# Altium schematic sheet radio.schdoc: Radio
size 431 x 279 mm; DrawnBy: D. Bruey, M.Ciuffo; Organization: Synapse Product Development, LLC.; Address1: 1511 6th Ave., Suite 400; Address2: Seattle, Washington 98101; Address3: 206.381.0898; Address4: www.synapse.com; DocumentNumber: 8; SheetNumber: 7; SheetTotal: 10; PageSetup: Record=PageOptions|CenterHorizontal=True|CenterVertical=True|PrintScale=0.95|XCorrection=1.00|YCorrection=1.00|PrintKind=1|BorderSize=5000000|LeftOffset=0|BottomOffset=0|Orientation=2|PaperLength=4318|PaperWidth=2794|Scale=100|PaperSource=7|PrintQuality=200|MediaType=1|DitherType=10|PrintScaleMode=1|PaperKind=11x17|PaperIndex=3
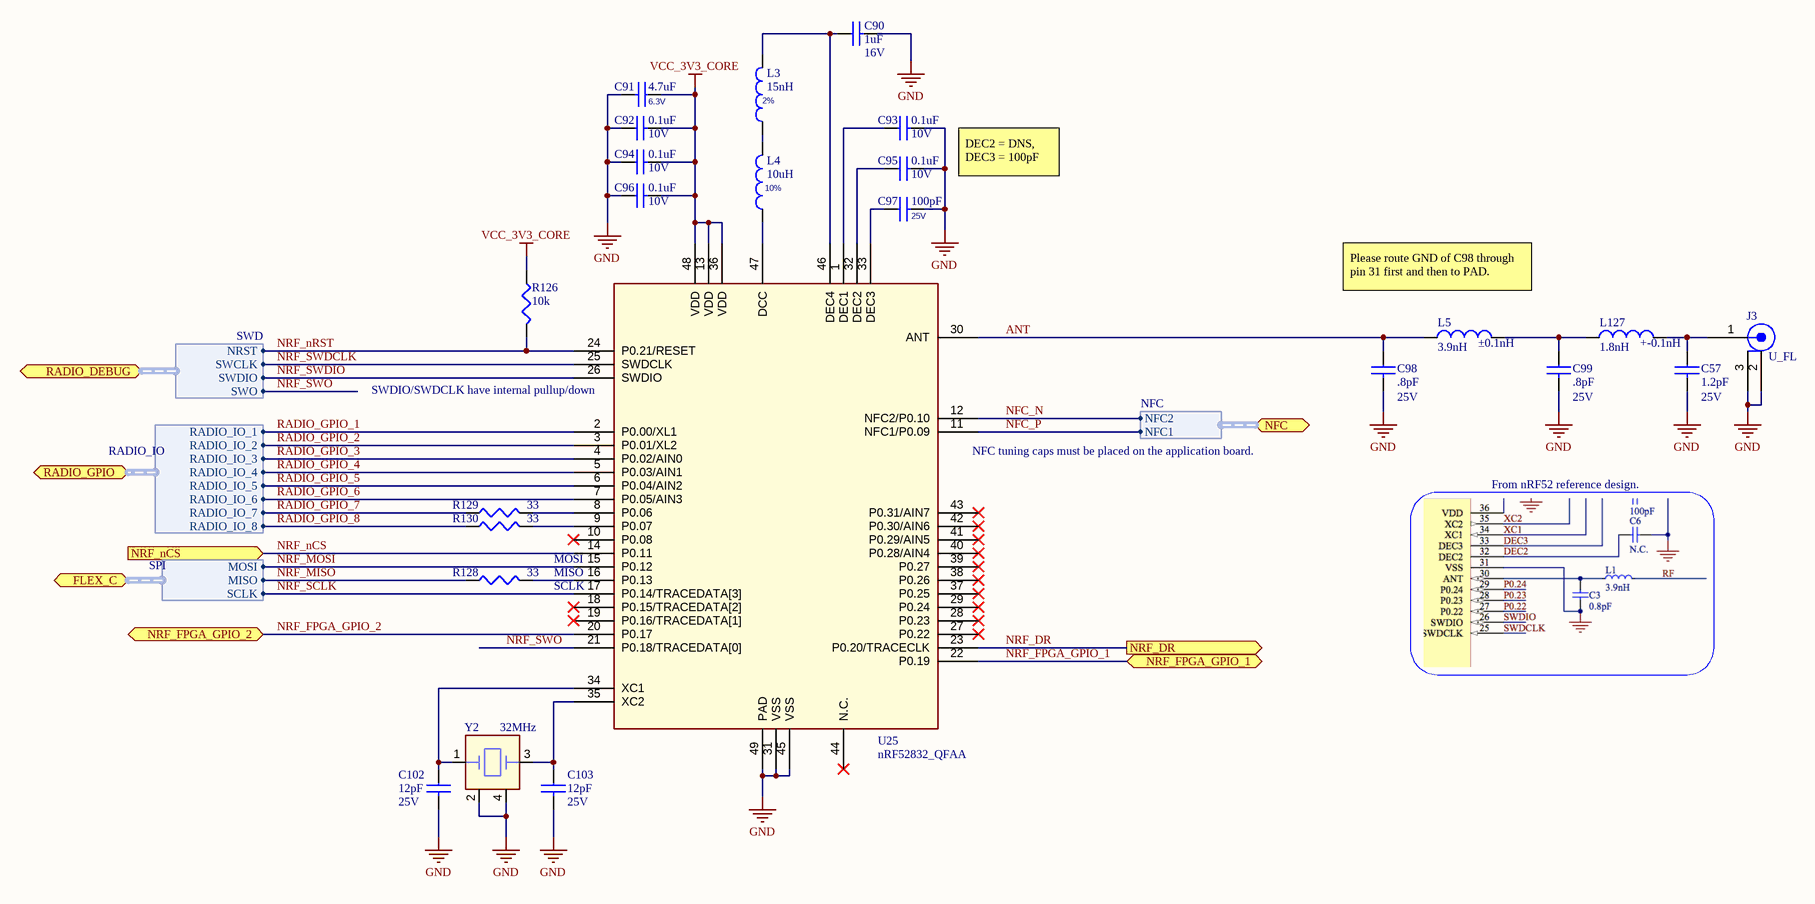
[diagram p0: radio.schdoc]

## Parts
C57  1.2pF  Voltage: 25V  [0201-IPCsm_33]
C90  1uF  Voltage: 16V  [0402-IPCsm_55]
C91  4.7uF  Voltage: 6.3V  [0402-IPCsm_55]
C92  0.1uF  Voltage: 10V  [0201-IPCsm_33]
C93  0.1uF  Voltage: 10V  [0201-IPCsm_33]
C94  0.1uF  Voltage: 10V  [0201-IPCsm_33]
C95  0.1uF  Voltage: 10V  [0201-IPCsm_33]
C96  0.1uF  Voltage: 10V  [0201-IPCsm_33]
C97  100pF  Voltage: 25V  [0201-IPCsm_33]
C98  .8pF  Voltage: 25V  [0201-IPCsm_33]
C99  .8pF  Voltage: 25V  [0201-IPCsm_33]
C102  12pF  Voltage: 25V  [0201-IPCsm_33]
C103  12pF  Voltage: 25V  [0201-IPCsm_33]
J3  U_FL  [con_hrs_U_FL-SMT]
L3  15nH  Tolerance: 2%  [IND_0402-36_LQP15M]
L4  10uH  Tolerance: 10%  [IND-0603_32H]
L5  3.9nH  Tolerance: ±0.1nH  [0201-IPCsm_33]
L127  1.8nH  Tolerance: +-0.1nH  [0201-IPCsm_33]
R126  10k  [0201-IPCsm_26]
R128  33  [0201-IPCsm_26]
R129  33  [0201-IPCsm_26]
R130  33  [0201-IPCsm_26]
U25  nRF52832_QFAA  [QFN48_6X6MM_NO_VIAS]
Y2  32MHz  [Xtal_abm12]

## Ports
FLEX_C (harness SPI), NFC (harness NFC), NRF_DR (out), NRF_FPGA_GPIO_1 (bidir), NRF_FPGA_GPIO_2 (bidir), NRF_nCS (in), RADIO_DEBUG (harness SWD), RADIO_GPIO (harness RADIO_IO)

## Harnesses
SWD: NRST, SWCLK, SWDIO, SWO
SPI: MOSI, MISO, SCLK
RADIO_IO: RADIO_IO_1, RADIO_IO_2, RADIO_IO_3, RADIO_IO_4, RADIO_IO_5, RADIO_IO_6, RADIO_IO_7, RADIO_IO_8
NFC: NFC2, NFC1

## Nets
GND: C57.2 C90.2 C91.2 C92.1 C93.2 C94.1 C95.2 C96.1 C97.2 C98.2 C99.2 C102.2 C103.2 J3.2(SHIELD) J3.3(SHIELD2) U25.31(VSS) U25.45(VSS) U25.49(PAD) Y2.2 Y2.4
VCC_3V3_CORE: C91.1 C92.2 C94.2 C96.2 R126.1 U25.13(VDD) U25.36(VDD) U25.48(VDD)
ANT: C98.1 L5.1 U25.30(ANT)
NFC_N: U25.12(NFC2/P0.10) ; port NFC.NFC2
NFC_P: U25.11(NFC1/P0.09) ; port NFC.NFC1
NRF_DR: U25.23(P0.20/TRACECLK) ; port NRF_DR
NRF_FPGA_GPIO_1: U25.22(P0.19) ; port NRF_FPGA_GPIO_1
NRF_FPGA_GPIO_2: U25.20(P0.17) ; port NRF_FPGA_GPIO_2
NRF_MISO: R128.1 ; port FLEX_C.MISO
NRF_MOSI: U25.15(P0.12) ; port FLEX_C.MOSI
NRF_nCS: U25.14(P0.11) ; port NRF_nCS
NRF_nRST: R126.2 U25.24(P0.21/RESET) ; port RADIO_DEBUG.NRST
NRF_SCLK: U25.17(P0.14/TRACEDATA[3]) ; port FLEX_C.SCLK
NRF_SWDCLK: U25.25(SWDCLK) ; port RADIO_DEBUG.SWCLK
NRF_SWDIO: U25.26(SWDIO) ; port RADIO_DEBUG.SWDIO
NRF_SWO: U25.21(P0.18/TRACEDATA[0]) ; port RADIO_DEBUG.SWO
RADIO_GPIO_1: U25.2(P0.00/XL1) ; port RADIO_GPIO.RADIO_IO_1
RADIO_GPIO_2: U25.3(P0.01/XL2) ; port RADIO_GPIO.RADIO_IO_2
RADIO_GPIO_3: U25.4(P0.02/AIN0) ; port RADIO_GPIO.RADIO_IO_3
RADIO_GPIO_4: U25.5(P0.03/AIN1) ; port RADIO_GPIO.RADIO_IO_4
RADIO_GPIO_5: U25.6(P0.04/AIN2) ; port RADIO_GPIO.RADIO_IO_5
RADIO_GPIO_6: U25.7(P0.05/AIN3) ; port RADIO_GPIO.RADIO_IO_6
RADIO_GPIO_7: R129.1 ; port RADIO_GPIO.RADIO_IO_7
RADIO_GPIO_8: R130.1 ; port RADIO_GPIO.RADIO_IO_8
NetC57_1: C57.1 J3.1(CENTER) L127.2
NetC90_1: C90.1 L3.2 U25.46(DEC4)
NetC93_1: C93.1 U25.1(DEC1)
NetC95_1: C95.1 U25.32(DEC2)
NetC97_1: C97.1 U25.33(DEC3)
NetC99_1: C99.1 L5.2 L127.1
NetC102_1: C102.1 U25.34(XC1) Y2.1
NetC103_1: C103.1 U25.35(XC2) Y2.3
NetL3_1: L3.1 L4.2
NetL4_1: L4.1 U25.47(DCC)
NetR128_2: R128.2 U25.16(P0.13)
NetR129_2: R129.2 U25.8(P0.06)
NetR130_2: R130.2 U25.9(P0.07)

Not connected (* = marked no-connect by the designer): U25 10(P0.08)* 18(P0.15/TRACEDATA[2])* 19(P0.16/TRACEDATA[1])* 27(P0.22)* 28(P0.23)* 29(P0.24)* 37(P0.25)* 38(P0.26)* 39(P0.27)* 40(P0.28/AIN4)* 41(P0.29/AIN5)* 42(P0.30/AIN6)* 43(P0.31/AIN7)* 44(N.C.)*

## Notes on the sheet
- DEC2 = DNS, DEC3 = 100pF
- Please route GND of C98 through pin 31 first and then to PAD.
- (near U25) SWDIO/SWDCLK have internal pullup/down
- (near U25) NFC tuning caps must be placed on the application board.
- From nRF52 reference design.
- MOSI
- MISO
- SCLK
- Design Notes:
- Layout Notes:
- Project:
- Sheet Title:
- PCBA:
- PROPRIETARY AND CONFIDENTIAL
- Drawn by:
- Schematic Part Number:
- Schematic Revision:
- Date:
- Sheet:
- /

## Library data of the parts
C57 = GJM0335C1E1R2BB01D: Multilayer Ceramic Capacitors MLCC - SMD/SMT 0201 1.2pF 25Volts C0G +/-0.1pF; id: 1351; mfg: Murata; dist: Mouser; dist_pn: 81-GJM0335C1E1R2BB01; source_package: C_1p20P_25V_NPO_0201; type: RF; tolerance: ±0.1pF; TableName: viewAltiumCapacitors; mfg_pn: GJM0335C1E1R2BB01D; part_type: capacitor; height: 0.3MM; status: Good
C90 = CL05A105KO5NNNC: CAP CER 1UF 16V X5R 0402; part_type: capacitor; id: 1304; mfg: Samsung Electro-Mechanics America, Inc.; dist: DIGIKEY; dist_pn: 1276-1067-1-ND; source_package: C_18P_50V_COG_0402; tolerance: 1%; TableName: viewAltiumCapacitors; mfg_pn: CL05A105KO5NNNC; type: X5R; height: 0.56MM; status: Unknown
C91 = GRM155R60J475ME47D: CAP CER 4.7UF 6.3V 20% X5R 0402; part_type: capacitor; id: 855; mfg: MURATA; dist: DIGIKEY; dist_pn: 490-5915-1-ND; symbol: \\SYNAPSEDEV.COM\DFS\FS\EE_STUFF\CAD_LIB\MASTER\MASTER_DISCRETE\CAP; allegro_footprint: 0402-IPCsm_55,c-0402_22H; source_package: C_4P7U_6.3V_X5R_0402; OrCADSymbol: MASTER_DISCRETE\CAP; TableName: viewAltiumCapacitors; mfg_pn: GRM155R60J475ME47D; type: X5R; tolerance: 20%; height: 0.55MM; status: Unknown; SymbolPath: C:\EE-Vault\Libraries\Schematic\MASTER_DISCRETE\CAP
C92-C96 = CL03A104KP3NNNC: CAP CER 0.1UF 10V 10% X5R 0201; part_type: capacitor; id: 1260; mfg: Samsung Electro-Mechanics America, Inc; dist: DIGIKEY; dist_pn: 1276-1115-2-ND; source_package: C_1U_10V_X5R_0201; TableName: viewAltiumCapacitors; mfg_pn: CL03A104KP3NNNC; type: X5R; tolerance: 10%; height: 0.33mm; status: Unknown
C97 = GRM0335C1E101JA01D: CAP CER 100PF 25V 5% NP0 0201; part_type: capacitor; id: 1234; mfg: MURATA; dist: DIGIKEY; dist_pn: 490-3160-6-ND; symbol: \\SYNAPSEDEV.COM\DFS\FS\EE_STUFF\CAD_LIB\MASTER\MASTER_DISCRETE\CAP; allegro_footprint: 0201-IPCsm_33,c-0201_13H; OrCADSymbol: MASTER_DISCRETE\CAP; TableName: viewAltiumCapacitors; mfg_pn: GRM0335C1E101JA01D; type: NP0; tolerance: 5%; height: 0.33MM; status: Good; SymbolPath: C:\EE-Vault\Libraries\Schematic\MASTER_DISCRETE\CAP
C98 = GJM0335C1ER80BB01D: 0.80pF ±0.1pF 25V C0G, NP0 Ceramic Capacitor -55°C ~ 125°C Surface Mount, MLCC 0201 (0603 Metric) 0.024" L x 0.012" W (0.60mm x 0.30mm); id: 1338; mfg: Murata Electronics North America; dist: Digikey; dist_pn: 490-6071-1-ND; source_package: C_1.8pF_25V_C0G_0201; tolerance: 0.05pF; TableName: viewAltiumCapacitors; mfg_pn: GJM0335C1ER80BB01D; part_type: capacitor; type: C0G, NP0; height: 0.33mm; status: Good
C99 = C0603C0G1E0R8W030BF: CAP CER 0.8PF 25V NP0 0201; part_type: capacitor; id: 1082; mfg: TDK Corporation; dist: Digikey; dist_pn: 445-7043-1-ND; source_package: C_1.8pF_25V_C0G_0201; type: C0G, NP0; tolerance: 0.05pF; TableName: viewAltiumCapacitors; mfg_pn: C0603C0G1E0R8W030BF; height: 0.33mm; status: Unknown
C102 C103 = GRM0335C1E120GA01D: 12pF 25V Ceramic Capacitor C0G, NP0 0201; id: 1361; mfg: Murata; dist: Digikey; dist_pn: 490-11967-1-ND; type: C0G, NPO; tolerance: 2%; TableName: viewAltiumCapacitors; mfg_pn: GRM0335C1E120GA01D; part_type: capacitor; height: 0.33MM; status: Unknown
J3 = U.FL-R-SMT(10): CONN RECPT ULTRA-MINI COAX SMD; part_type: connector; id: 944; mfg: HIROSE; dist: DIGIKEY; dist_pn: H9161CT-ND; positions: 1; TableName: viewAltiumConnectors; mfg_pn: U.FL-R-SMT(10); source_package: U_FL; height: 1.25MM; status: Unknown
L3 = LQP15MN15NG02D: IND, 15 nH, 2%, 0402; part_type: inductor; id: 590; mfg: Murata; dist: Digikey; dist_pn: 490-6745-1-ND; symbol: \\synapsedev.com\dfs\FS\EE_STUFF\CAD_LIB\MASTER\MASTER_DISCRETE\IND_H; allegro_footprint: ind_0402-36_lqpq15; source_package: INDUCTOR_4.7nH_0402; OrCADSymbol: MASTER_DISCRETE\IND_H; TableName: viewAltiumInductors; mfg_pn: LQP15MN15NG02D; height: 0.36MM; status: Unknown; SymbolPath: C:\EE-Vault\Libraries\Schematic\MASTER_DISCRETE\IND_H
L4 = CBMF1608T100K: INDUCTOR 10UH 115MA 0603; id: 577; mfg: Taiyo Yuden; dist: DIGIKEY; dist_pn: 587-1720-1-ND; symbol: \\synapsedev.com\dfs\FS\EE_STUFF\CAD_LIB\MASTER\MASTER_DISCRETE\IND_H; source_package: INDUCTOR_10uH_0603; srf: 32MHz; OrCADSymbol: MASTER_DISCRETE\IND_H; TableName: viewAltiumInductors; mfg_pn: CBMF1608T100K; part_type: inductor; allegro_footprint: ind-0603_32H; height: 1MM; current: 115mA; status: Unknown; SymbolPath: C:\EE-Vault\Libraries\Schematic\MASTER_DISCRETE\IND_H
L5 = LQP03TN3N9B02D: FIXED IND 3.9NH 400MA 300 MOHM 0201; part_type: inductor; id: 701; mfg: Murata; dist: DIGIKEY; dist_pn: 490-6730-1-ND; srf: 5.7GHz; TableName: viewAltiumInductors; mfg_pn: LQP03TN3N9B02D; height: 0.33mm; current: 400mA; status: Unknown
L127 = LQP03TN1N8B02D: FIXED IND 1.8NH 600MA 150 MOHM; part_type: inductor; id: 729; mfg: MURATA; dist: DIGIKEY; dist_pn: 490-12981-1-ND; srf: 15000MHz; TableName: viewAltiumInductors; mfg_pn: LQP03TN1N8B02D; height: 0.33MM; current: 600mA; status: Unknown
R126 = RC0201FR-0710KL: RES 10K OHM 1/20W 1% 0201 SMD; part_type: resistor; Tolerance: 1.00%; Voltage: 50V; DIST: DIGIKEY; MFG: YAGEO; DIST_PN: 311-10.0KMCT-ND; Power: 0.05W; id: 1527; source_package: R_10k_0201_1P; TableName: viewAltiumResistors; Height: .26MM; MFG_PN: RC0201FR-0710KL; status: Unknown
R128-R130 = RC0201FR-0733R: RES 33 OHM 1/20W 1% 0201 SMD; part_type: resistor; Tolerance: 1.00%; Voltage: 50V; DIST: DIGIKEY; MFG: YAGEO; DIST_PN: 311-33.0MCT-ND; Power: 0.05W; id: 1544; source_package: R_33_0201_1P; TableName: viewAltiumResistors; Height: .26MM; MFG_PN: RC0201FR-0733R; status: Unknown
U25 = nRF52832-QFAA: IC SOC 2.4GHZ 512K FLASH QFN; Manufacturer: Nordic Semiconductor; Artikkelnr Noca: N.A.; id: 2400; mfg: Nordic; dist: Digikey; dist_pn: 1490-1052-1-ND; TableName: viewAltiumIcs; allegro_footprint: qfn40p600x600x90-49; symbol: \\SYNAPSEDEV.COM\DFS\FS\EE_STUFF\CAD_LIB\MASTER\MASTER_IC\nRF52832_QFAA; where_used: Houston; Part Number: nRF52832-QFAA; Manufacturer Part Number: nRF52832-QFAA; LatestRevisionDate: 2014-11-26; Pin Count: 48; Publisher: Nordic Semiconductor; Published: 2014-11-26; Value: nRF52832-QFAA; Note: *; Supplier: Nordic Semiconductor; Supplier part number: *; 2nd source Supplier: *; 2nd source part number: *; Footprint Doc: QFN-48; Artikkelnr Simpro: N.A.; mfg_pn: nRF52832-QFAA; part_type: ic; source_package: nRF52832; height: 0.9mm; status: Unknown
Y2 = ABM12-32.000MHZ-B2X-T3: Crystal 32.0000MHz 20ppm 8pF 100 Ohm -20°C - 70°C Surface Mount 4-SMD, No Lead (DFN, LCC); id: 1168; mfg: Abracon LLC; dist: Digikey; dist_pn: 535-10256-1-ND; TableName: viewAltiumMisc; mfg_pn: ABM12-32.000MHZ-B2X-T3; part_type: crystal; source_package: ABM12-32.000MHZ-B2X-T3; tolerance: 20ppm; height: .45mm; status: Unknown; datasheet: http://www.abracon.com/Resonators/ABM12.pdf